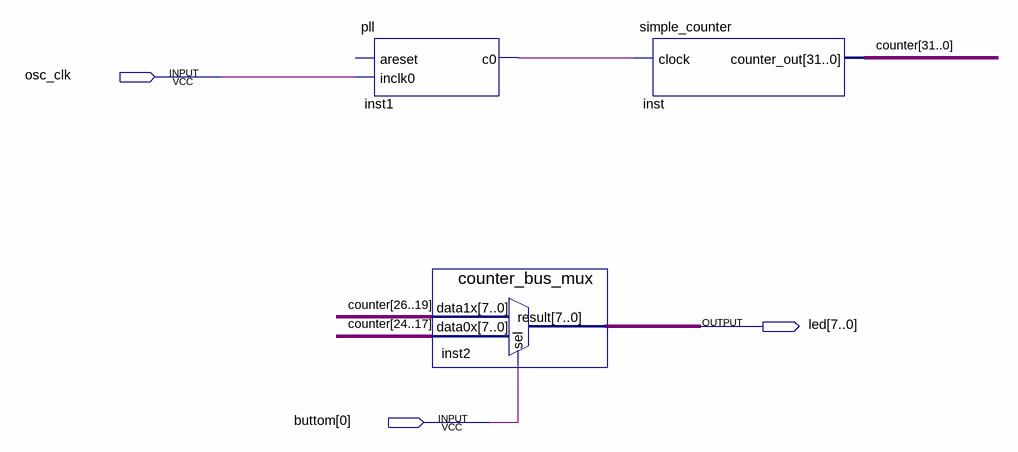
[diagram p0: schematic sheet]
// Quartus schematic my_first_fpga_top.bdf as structural Verilog: 3 symbols, 3 pins
module my_first_fpga_top (
  input  osc_clk,
  input  [0:0] buttom,
  output [7:0] led
);

  wire inst1_c0;
  wire [31:0] counter;

  pll inst1 (.inclk0(osc_clk), .c0(inst1_c0));  // open: areset
  counter_bus_mux inst2 (.data1x(counter[26:19]), .data0x(counter[24:17]), .sel(buttom[0]), .result(led));
  simple_counter inst (.clock(inst1_c0), .counter_out(counter));
endmodule
